# EAGLE schematic MasterAlternativo10 (EAGLE 6.2)
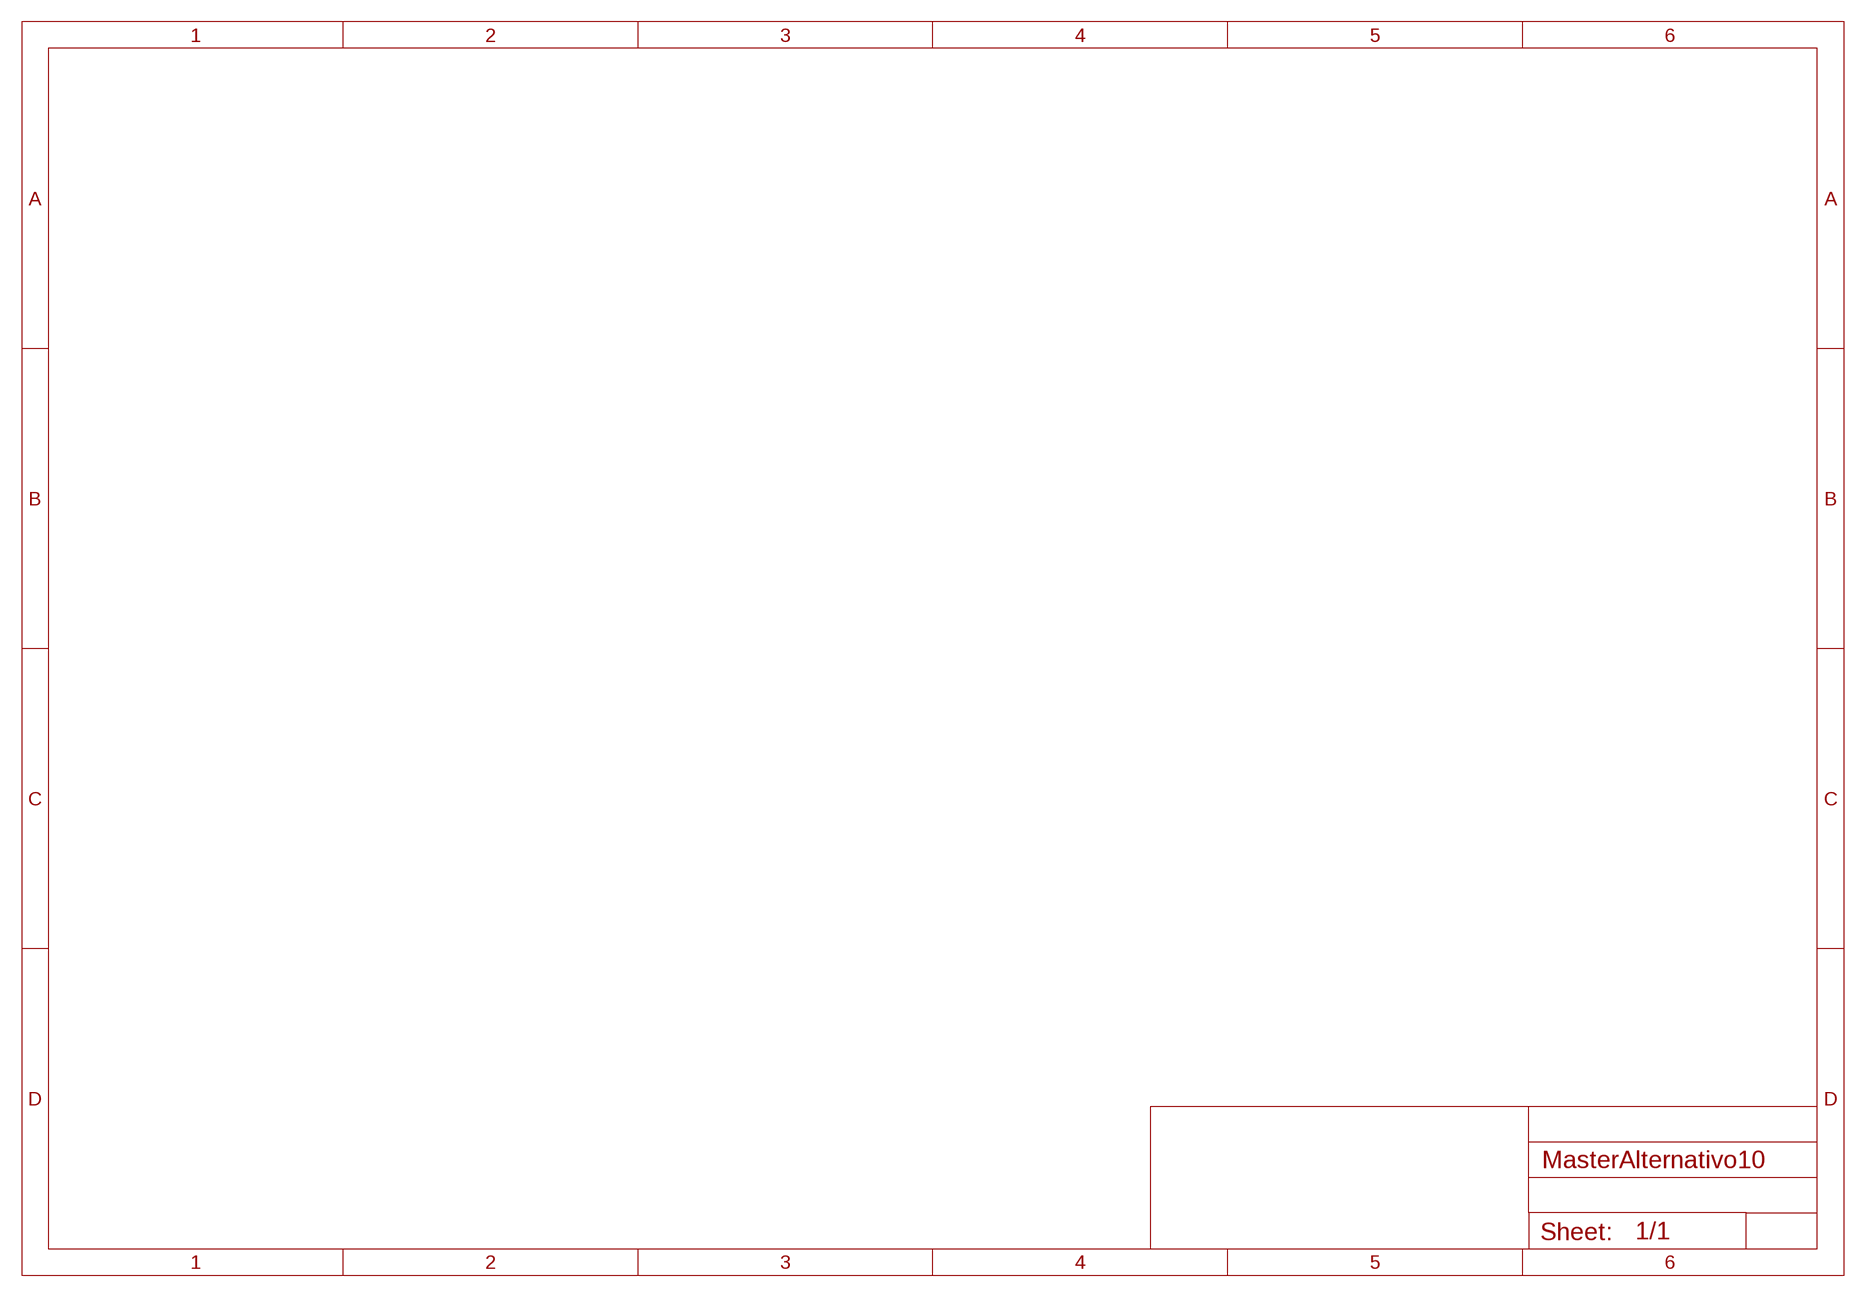
[diagram p0: schematic, sheet 1, part 1 of 2]
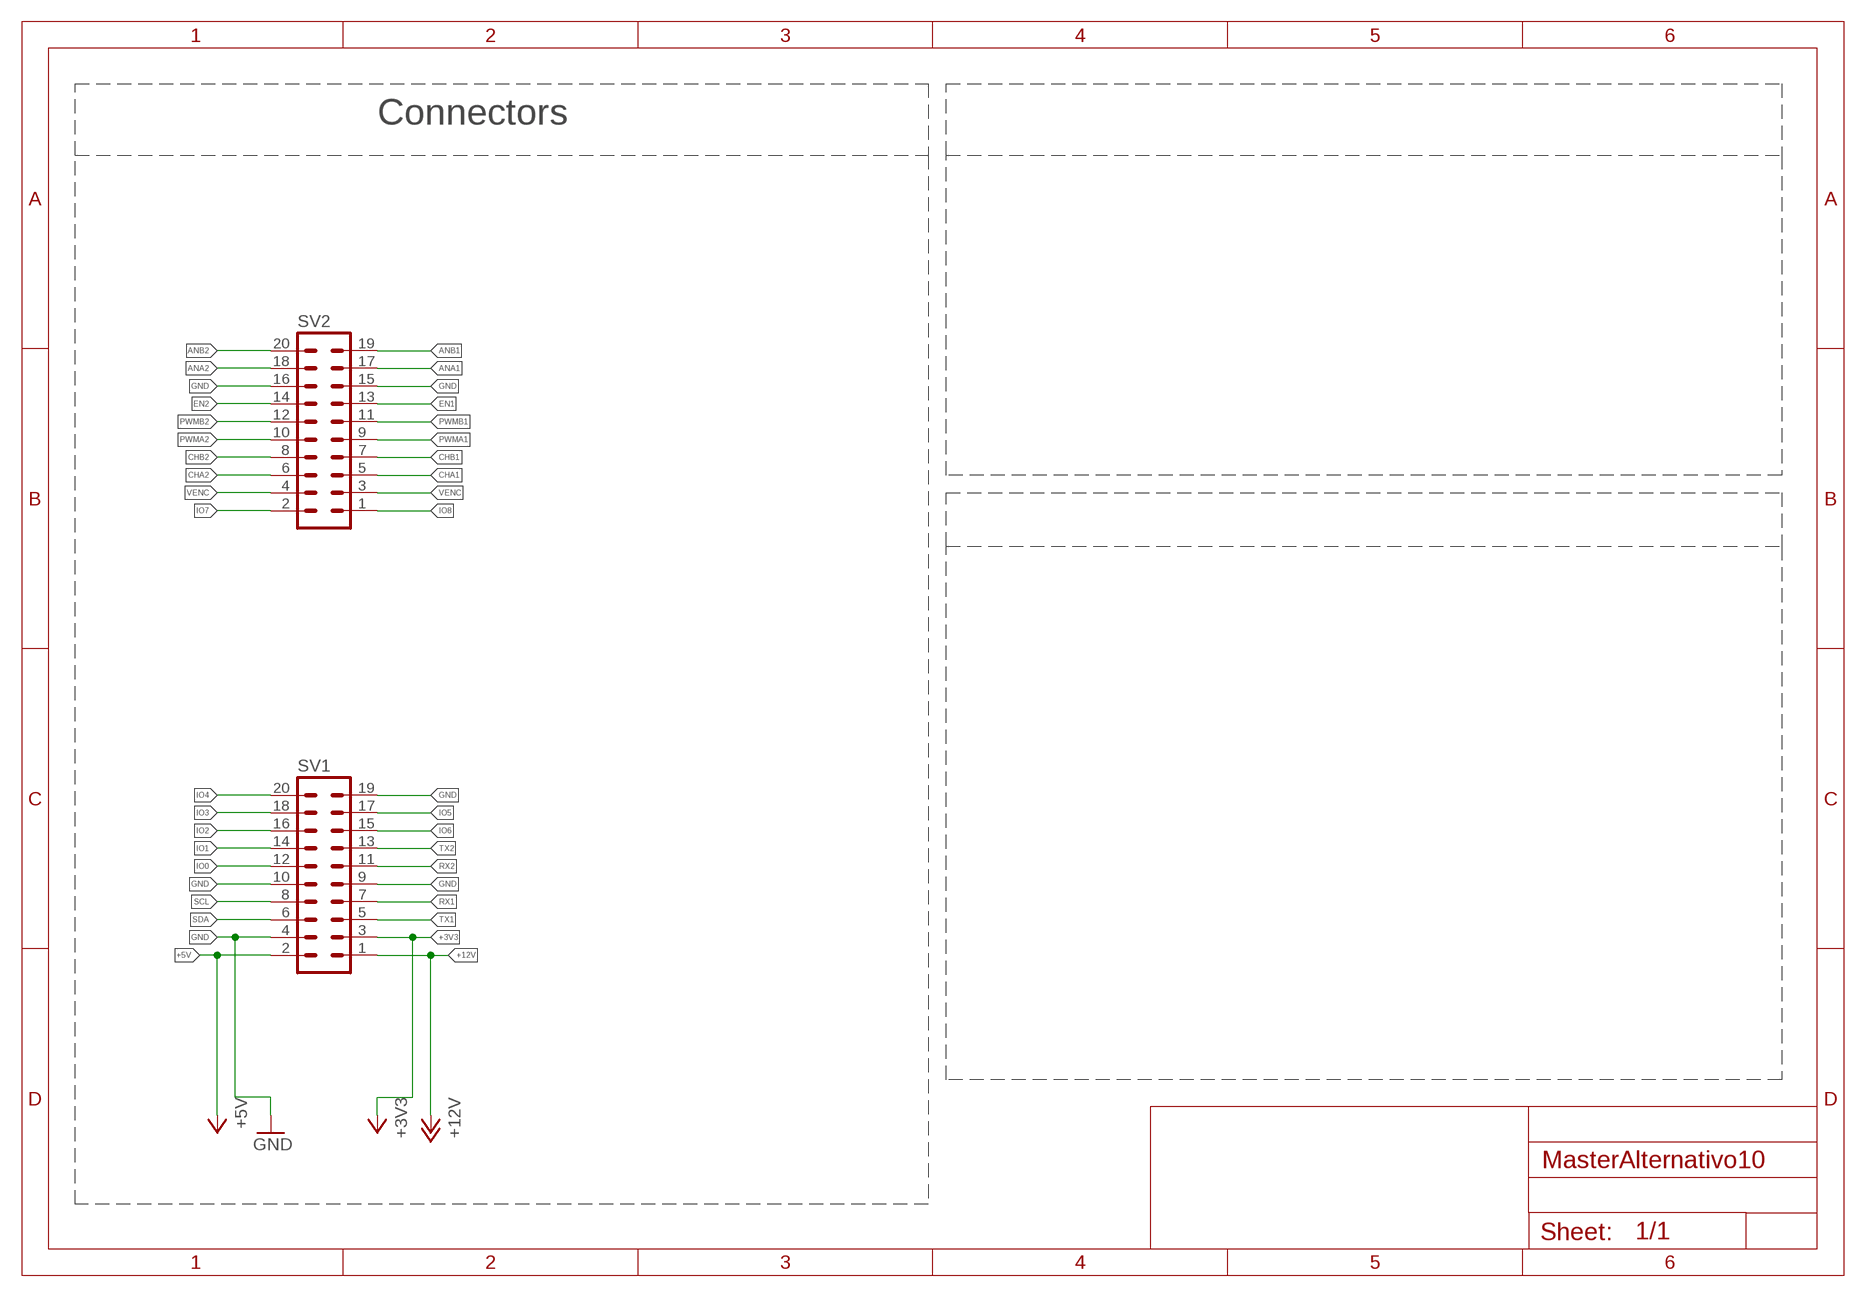
[diagram p1: schematic, sheet 1, part 2 of 2]

## Parts
SV1  MA10-2  [MA10-2]
SV2  MA10-2  [MA10-2]

## Nets
+3V3: SV1.3
+5V: SV1.2
+12V: SV1.1
ANA1: SV2.17
ANA2: SV2.18
ANB1: SV2.19
ANB2: SV2.20
CHA1: SV2.5
CHA2: SV2.6
CHB1: SV2.7
CHB2: SV2.8
EN1: SV2.13
EN2: SV2.14
GND: SV1.4 SV1.9 SV1.10 SV1.19 SV2.15 SV2.16
IO0: SV1.12
IO1: SV1.14
IO2: SV1.16
IO3: SV1.18
IO4: SV1.20
IO5: SV1.17
IO6: SV1.15
IO7: SV2.2
IO8: SV2.1
PWMA1: SV2.9
PWMA2: SV2.10
PWMB1: SV2.11
PWMB2: SV2.12
RX1: SV1.7
RX2: SV1.11
SCL: SV1.8
SDA: SV1.6
TX1: SV1.5
TX2: SV1.13
VENC: SV2.3 SV2.4

## Notes on the sheet
- Connectors

## Library data of the parts
SV1 SV2 = con-lstb:MA10-2: PIN HEADER; OC_FARNELL: unknown; OC_NEWARK: unknown

## Net classes
0 default: width 0.203 mm, clearance 0.203 mm
1 power: width 0.305 mm, clearance 0.203 mm